# Altium project WashingMachine.PrjPcb
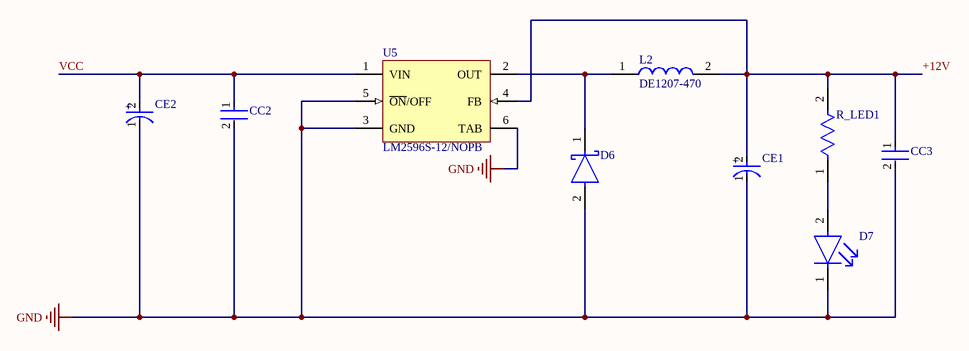
[diagram p0: PowerSupply.SchDoc]
5 sheets, 103 parts. Net scope: global (net labels, ports and power ports of the same name join across sheets).
Board file: PCB1.PcbDoc
Sheets:
  PowerSupply.SchDoc
  HBridge.SchDoc
  Microcontroller.SchDoc
  Relay.SchDoc
  Triac.SchDoc

## Sheet PowerSupply.SchDoc
size A; SheetNumber: 1; SheetTotal: 5

### Parts
CC2  12062C104K4T2A  [FP-1206-L_3_2_0_2-W_1_6_0-IPC_A]  (value not drawn)
CC3  12062C104K4T2A  [FP-1206-L_3_2_0_2-W_1_6_0-IPC_A]  (value not drawn)
CE1  EEV-FK2A221M  [FP-FKK16-MFG]  (value not drawn)
CE2  50THV100M10X10.5  [FP-THV10X10_5-MFG]  (value not drawn)
D6  SS34-E3/57T  [FP-95402-MFG]  (value not drawn)
D7  SML-LX0603SIW-TR  [FP-SML-LX0603SIW-TR-MFG]  (value not drawn)
L2  DE1207-470  [DE1207330]
R_LED1  CRCW0805220RJNEA  [FP-CRCW0805-e3-IPC_A]  (value not drawn)
U5  LM2596S-12/NOPB  [KTT0005B_M]

### Nets
+12V: CC3.1 CE1.2(A) L2.2 R_LED1.2 U5.4(FB)
GND: CC2.2 CC3.2 CE1.1(C) CE2.1(C) D6.2(A) D7.1(C) U5.3(GND) U5.5(~{ON}/OFF) U5.6(TAB)
VCC: CC2.1 CE2.2(A) U5.1(VIN)
NetD6_1: D6.1(C) L2.1 U5.2(OUT)
NetD7_2: D7.2(A) R_LED1.1

### Notes on the sheet
- (in symbol CMP-05427-000076-1) +
- (in symbol CMP-35376-000015-1) +

### Library data of the parts
CC2 CC3 = CMP-04427-012685-1: Automotive Ceramic Capacitor, 1206, 100nF, 10%, X7R, 15%, 200V; Voltage Rating (DC): 200V; Case/Package: 1206; Length: 3.2mm; Max Operating Temperature: 125°C; Termination: SMD/SMT; Width: 1.6mm; Lead Free: Lead Free; Package Quantity: 2000; Min Operating Temperature: -55°C; Capacitance: 100nF; Height: 1.52mm; Depth: 1.6mm; Dielectric: X7R; Case Code (Metric): 3216; Packaging: Tape and Reel; Case Code (Imperial): 1206; Tolerance: 10%
CE1 = CMP-05427-000076-1: CAP ALUM 220UF 20% 100V SMD; Dielectric Material: Aluminium; Ripple Current (AC): 917mA; Life (Hours): 5000Hour; Leakage Current: 3uA; Impedance: 153mR; Height: 16.5mm; Min Operating Temperature: -55°C; Lead Free: Lead Free; Series: FK; Capacitance: 220uF; Construction: Cylindrical; Package Quantity: 1; Height - Seated (Max): 0.65inch; REACH SVHC: No SVHC; Diameter: 18mm; Tolerance: 20%; Voltage Rating (DC): 100V; Mount: Surface Mount; Termination: SMD/SMT; Case/Package: Radial; Voltage Rating: 100V; Ripple Current: 917mA; Packaging: Tape and Reel; Max Operating Temperature: 105°C; Voltage: 100V; RoHS Compliant: Yes; Length: 17mm; Width: 1.2mm; ESR (Equivalent Series Resistance): 153mR; Contact Plating: Tin; Radiation Hardening: No; Number of Pins: 2
CE2 = CMP-35376-000015-1: CAP ALUM 100UF 20% 50V SMD; Ripple Current: 175mA; Ripple Current (AC): 350mA; ESR (Equivalent Series Resistance): 250mR; Life (Hours): 3000Hour; Max Operating Temperature: 125°C; Height: 10.5mm; Package Quantity: 1; Radiation Hardening: No; Diameter: 10mm; Capacitance: 100uF; Case/Package: Radial; RoHS Compliant: Yes; Voltage: 50V; REACH SVHC: No SVHC; Packaging: Cut Tape; Height - Seated (Max): 0.413inch; Voltage Rating: 50V; Min Operating Temperature: -40°C; Mount: Surface Mount; Termination: SMD/SMT; Series: THV; Construction: Cylindrical; Voltage Rating (DC): 50V; Tolerance: 20%
D6 = CMP-02539-000012-1: DIODE SCHOTTKY 40V 3A DO214AB; Manufacturer: Vishay; Max Junction Temp: +150°C; Peak Reverse Current: 0.5mA; Max Surge Forward Current: 100A; Standoff Height: 0mm; ComponentLink2Description: Datasheet; Device Class L3: Schottky Diodes; Height: 2.62mm; Max Repetitive Reverse Voltage: 40V; Lead Free: Yes; Package: 95402; Temperature Range High: +150°C; ComponentLink2URL: http://www.vishay.com/docs/88751/ss32.pdf; Temperature: -55°C to +150°C; Footprint Url: http://www.vishay.com/docs/95402/smc.pdf; Automotive: No; Forward Current: 3A; Category: Diode; Manufacturer Part Number: SS34-E3/57T; RoHS: TRUE; Device Class L2: Diodes; Mouser Description: Schottky Diodes & Rectifiers 3.0 Amp 40 Volt; Octopart: https://octopart.com/ss34-e3%2F57t-vishay-39552907; Temperature Range Low: -55°C; Device Class L1: Discrete Semiconductors; Digikey Description: DIODE SCHOTTKY 40V 3A DO214AB
D7 = CMP-57192-000009-1: LED RED DIFFUSED SMD; Test Current: 20mA; Forward Voltage: 2V; Approvals: UL; Dominant Wavelength: 636nm; Viewing Angle: 140°; Lens Color: White; Luminous Intensity: 60mcd; Power Rating: 50mW; Number of LEDs: 1; Color: Red; Forward Current: 20mA; Moisture Sensitivity Level: 2; Case Code (Imperial): 0603; Lead Free: Lead Free; Lens Transparency: Diffused; Case Code (Metric): 1608; Height: 0.6mm; Max Operating Temperature: 85°C; Width: 0.8mm; Lens Style: Diffused; Illumination Color: Red; Wavelength: 636nm; REACH SVHC: No SVHC; Package Quantity: 1; RoHS Compliant: Yes; Case/Package: 0603; Number of Pins: 2; Packaging: Tape and Reel; Length: 1.6mm; Mount: Surface Mount; Min Operating Temperature: -25°C
L2 = DE1207-330: Inductor; Manufacturer_Name: FERROCORE; Datasheet Link: https://www.tme.eu/Document/d1f8b47d020ebf11f3b92c6891638dfa/de.pdf; Height: 8mm; Manufacturer_Part_Number: DE1207-330
R_LED1 = CMP-2001-03683-2: RES Thick Film, 220Ω, 5%, 0.125W, 200ppm/°C, 0805; Voltage Rating: 150V; Power Rating: 125mW; Resistance: 220R; Case Code (Metric): 2012; Height: 0.45mm; Radiation Hardening: No; Contact Plating: Tin; Voltage Rating (DC): 150V; Packaging: Tape and Reel; Lead Free: Lead Free; Military Standard: Not; Temperature Coefficient: 200ppm/°C; Width: 1.25mm; Case Code (Imperial): 0805; Termination: SMD/SMT; Tolerance: 5%; Depth: 1.25mm; Package Quantity: 5000; Weight: 0.000194oz; Length: 2mm; Min Operating Temperature: -55°C; Composition: Thick Film; Case/Package: 0805; Max Operating Temperature: 155°C
U5 = CMP-0069-00273-3: SIMPLE SWITCHER® Power Converter 150 KHz 3A Step-Down Voltage Regulator, 5-pin TO-263, Pb-Free; Manufacturer: Texas Instruments; PowerWise: N; PackageTopMarking: NSUZXYTTE#*LM2596S*-12 P+; PinCount: 5; ComponentLink1Description: Datasheet URL; PackageDescription: TO-263, Molded, .400 x .390 x .180in, 5 Lead, .067in Pitch, Surface Mount; Code_JEDEC: MO-169-AB; RoHS: Y; PackageReference: KTT0005B; ComponentLink1URL: http://www.ti.com/general/docs/lit/getliterature.tsp?genericPartNumber=LM2596&fileType=pdf; CompType: Switcher

## Sheet HBridge.SchDoc
size A3; SheetNumber: 2; SheetTotal: 5
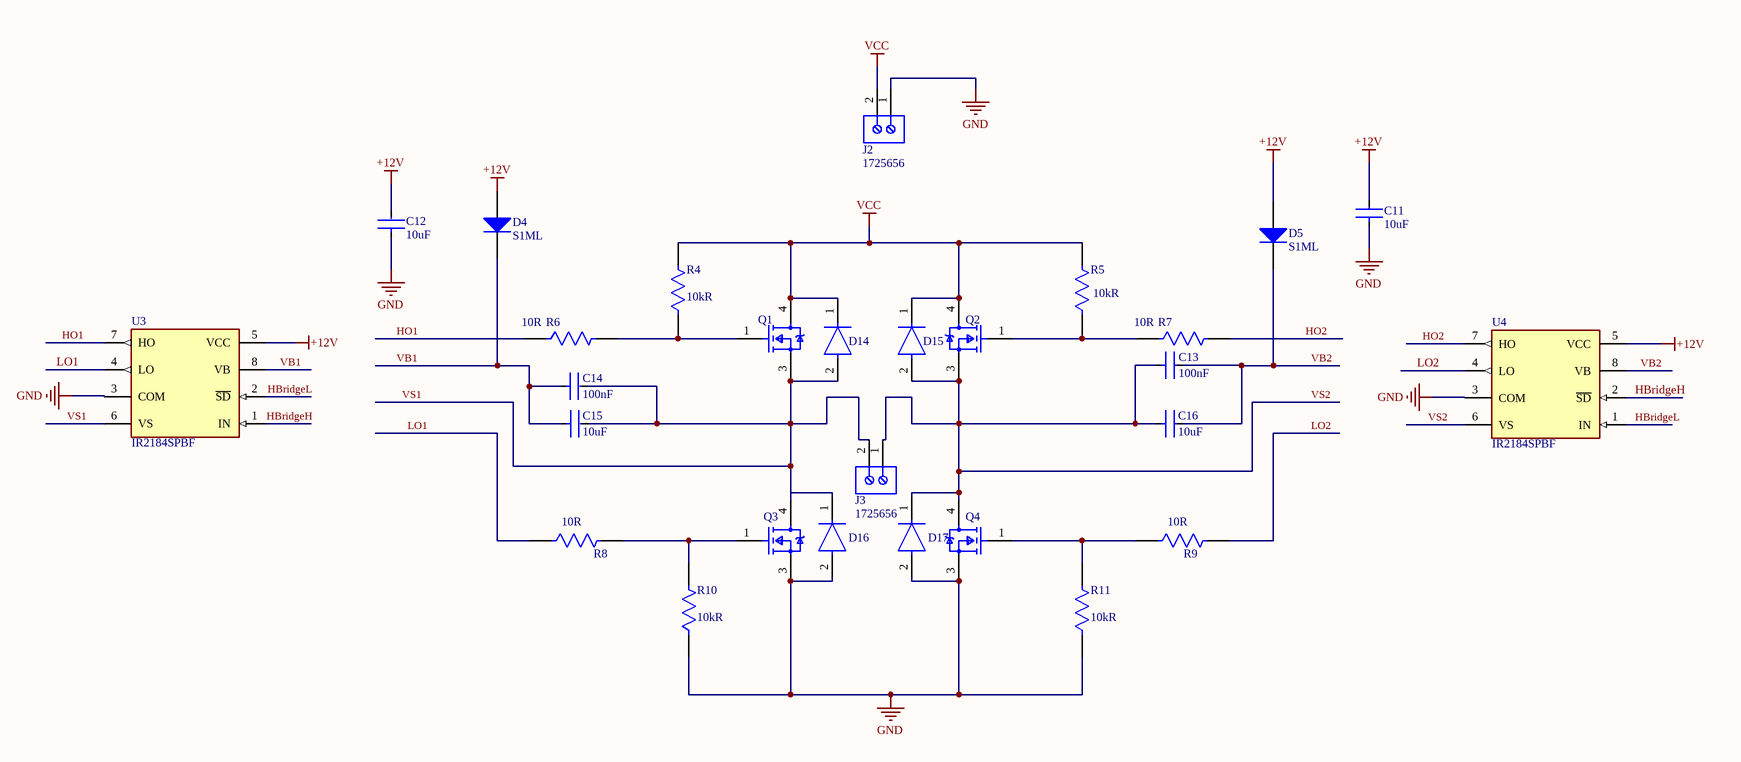
[diagram p1: HBridge.SchDoc]

### Parts
C11  Capacitance: 10uF  [FP-CL21-IPC_B]  (hidden comment: CL21A106KOQNNNE)
C12  Capacitance: 10uF  [FP-CL21-IPC_B]  (hidden comment: CL21A106KOQNNNE)
C13  Capacitance: 100nF  [FP-CL21-IPC_C]  (hidden comment: CL21B104KBCNNNC)
C14  Capacitance: 100nF  [FP-CL21-IPC_C]  (hidden comment: CL21B104KBCNNNC)
C15  Capacitance: 10uF  [FP-CL21-IPC_B]  (hidden comment: CL21A106KOQNNNE)
C16  Capacitance: 10uF  [FP-CL21-IPC_B]  (hidden comment: CL21A106KOQNNNE)
D4  S1ML  [TWS-S1ML_V]
D5  S1ML  [TWS-S1ML_V]
D14  1N4148WQ-7-F  [FP-SOD123-MFG]  (value not drawn)
D15  1N4148WQ-7-F  [FP-SOD123-MFG]  (value not drawn)
D16  1N4148WQ-7-F  [FP-SOD123-MFG]  (value not drawn)
D17  1N4148WQ-7-F  [FP-SOD123-MFG]  (value not drawn)
J2  1725656  [PHOE-1725656-2]
J3  1725656  [PHOE-1725656-2]
Q1  IRLZ44NSTRLPBF  [FP-PG-TO263-3-MFG]  (value not drawn)
Q2  IRLZ44NSTRLPBF  [FP-PG-TO263-3-MFG]  (value not drawn)
Q3  IRLZ44NSTRLPBF  [FP-PG-TO263-3-MFG]  (value not drawn)
Q4  IRLZ44NSTRLPBF  [FP-PG-TO263-3-MFG]  (value not drawn)
R4  Resistance: 10kR  [FP-MCA1206-IPC_B]  (hidden comment: MCA1206MD1002DP500)
R5  Resistance: 10kR  [FP-MCA1206-IPC_B]  (hidden comment: MCA1206MD1002DP500)
R6  Resistance: 10R  [FP-RMCF0805-IPC_B]  (hidden comment: RMCF0805FG10R0)
R7  Resistance: 10R  [FP-RMCF0805-IPC_B]  (hidden comment: RMCF0805FG10R0)
R8  Resistance: 10R  [FP-RMCF0805-IPC_B]  (hidden comment: RMCF0805FG10R0)
R9  Resistance: 10R  [FP-RMCF0805-IPC_B]  (hidden comment: RMCF0805FG10R0)
R10  Resistance: 10kR  [FP-MCA1206-IPC_B]  (hidden comment: MCA1206MD1002DP500)
R11  Resistance: 10kR  [FP-MCA1206-IPC_B]  (hidden comment: MCA1206MD1002DP500)
U3  IR2184SPBF  [FP-PG-DSO-8-MFG]
U4  IR2184SPBF  [FP-PG-DSO-8-MFG]

### Nets
+12V: C11.2 C12.2 D4.1(A) D5.1(A) U3.5(VCC) U4.5(VCC)
GND: C11.1 C12.1 D16.2(A) D17.2(A) J2.1 Q3.3(S) Q4.3(S) R10.1 R11.1 U3.3(COM) U4.3(COM)
VCC: D14.1(C) D15.1(C) J2.2 Q1.4(D) Q2.4(D) R4.2 R5.2
HBridgeH: U3.1(IN) U4.2(~{SD})
HBridgeL: U3.2(~{SD}) U4.1(IN)
HO1: R6.1 U3.7(HO)
HO2: R7.2 U4.7(HO)
LO1: R8.1 U3.4(LO)
LO2: R9.2 U4.4(LO)
VB1: C14.1 C15.1 D4.2(K) U3.8(VB)
VB2: C13.2 C16.2 D5.2(K) U4.8(VB)
VS1: C14.2 C15.2 D14.2(A) D16.1(C) J3.2 Q1.3(S) Q3.4(D) U3.6(VS)
VS2: C13.1 C16.1 D15.2(A) D17.1(C) J3.1 Q2.3(S) Q4.4(D) U4.6(VS)
NetQ1_1: Q1.1(G) R4.1 R6.2
NetQ2_1: Q2.1(G) R5.1 R7.1
NetQ3_1: Q3.1(G) R8.2 R10.2
NetQ4_1: Q4.1(G) R9.1 R11.2

### Library data of the parts
C11 C12 C15 C16 = CMP-2000-06102-2: CL21 Series 0805 10uF 16V ±10% Tolerance X5R Multilayer Ceramic Chip Capacitor; Dielectric: X7R; Length: 2mm; Depth: 1.25mm; Voltage: 16V; Width: 0.049inch; Lead Free: Lead Free; Max Operating Temperature: 85°C; Mount: Surface Mount; Voltage Rating: 16V; Height: 1.25mm; Radiation Hardening: No; Packaging: Tape and Reel; Voltage Rating (DC): 16V; Thickness: 0.055inch; Case/Package: 0805; Case Code (Imperial): 0805; Min Operating Temperature: -55°C; Case Code (Metric): 2012; Package Quantity: 1; Tolerance: 10%
C13 C14 = CMP-2000-05017-2: CL21 Series 0805 100nF 50V ±10% Tolerance X7R Multilayer Ceramic Chip Capacitor; Depth: 1.25mm; Height: 0.85mm; Width: 0.049inch; Tolerance: 10%; Case Code (Metric): 2012; Case Code (Imperial): 0805; Material: Ceramic; Thickness: 0.037inch; Min Operating Temperature: -55°C; Contact Plating: Tin; Length: 2mm; Mount: Surface Mount; Voltage Rating (DC): 50V; Lead Free: Lead Free; Dielectric: X7R; Radiation Hardening: No; Voltage Rating: 50V; Case/Package: 0805; Packaging: Tape and Reel; Max Operating Temperature: 125°C; Voltage: 50V
D4 D5 = CMP-2000-07014-1: Rectifier, 1 A, 1.1 V, -55 to 175 degC, 2-Pin SMD, RoHS, Tape and Reel; Manufacturer: Taiwan Semiconductor; Forward Current If(AV): 1A; Forward Voltage VF Max: 1.1V; Diode Configuration: Single; Reverse Recovery Time trr Max: 1.8µs; Forward Surge Current Ifsm Max: 30A; SVHC: NoSVHC(15-Jun-2015); Repetitive Reverse Voltage Vrrm Max: 1kV; No. of Pins: 2Pin; Mounting Technology: SurfaceMount; Package Reference: S1ML; Datasheet URL: http://www.taiwansemi.com/products/datasheet/S1AL%20SERIES_O15.pdf; Manufacturer URL: http://www.taiwansemi.com/; Package Description: 2-Pin Surface Mount Device, Body 2.8 x 1.8 mm; Product Range: -; Diode Case Style: SMD; Datasheet Version: Rev. O15, 05/2015; Packaging: CutTape; Operating Temperature Max: 150°C
D14-D17 = CMP-12791-000025-1: DIODE GEN PURP 100V 300MA SOD123; Manufacturer: Diodes Inc.; Value: 2pF; Standoff Height: 0mm; Automotive Grade: Grade 0; Max Junction Temp: +150°C; Max Surge Forward Current: 1A; Peak Reverse Current: 1uA; Forward Current: 300mA; Temperature: -65°C to +150°C; Device Class L3: Rectifier Diodes; Manufacturer Part Number: 1N4148WQ-7-F; Temperature Range Low: -65°C; Device Class L1: Discrete Semiconductors; Reverse Voltage: 100V; Automotive: Yes; Temperature Range High: +150°C; Octopart: https://octopart.com/1n4148wq-7-f-diodes+inc.-34965875; ComponentLink2URL: https://www.diodes.com/assets/Datasheets/ds30086.pdf; Max Repetitive Reverse Voltage: 100V; Mouser Description: Diode Switching 100V 0.15A Automotive 2-Pin SOD-123 T/R; Ipc Land Pattern Name: SOD365155X123-2; RoHS: TRUE; Height: 1.45mm; ComponentLink2Description: Datasheet; Category: Diode; Footprint Url: https://www.diodes.com/assets/Package-Files/SOD123.pdf; Package: SOD123; Device Class L2: Diodes; Lead Free: Yes; Capacitance: 2pF; Digikey Description: DIODE GEN PURP 100V 300MA SOD123
J2 J3 = CMP-2000-05299-1: Male Header, Pitch 2.54 mm, 1 x 2 Position, Height 9 mm, Tail Length 3.5 mm; Manufacturer: Phoenix Contact; Number of contacts: 2; Content: 250pc(s); Pitch: 2.54mm; Industrial packaging: Yes; Colour: Green; Manufacturer part No.: 1725656; Type: MPT0,5/2-2,54; Datasheet URL: http://datasheet.octopart.com/1725656-Phoenix-Contact-datasheet-5302866.pdf; Manufacturer URL: http://www.phoenixcontact.com/; Datasheet Version: Apr-08
Q1-Q4 = CMP-32901-000495-1: MOSFET N-CH 55V 47A D2PAK; Rds On Max: 22mR; Input Capacitance: 1.7nF; Turn-On Delay Time: 11ns; Turn-Off Delay Time: 26ns; Power Dissipation: 110W; Element Configuration: Single; Gate to Source Voltage (Vgs): 16V; Drain to Source Resistance: 35mR; Threshold Voltage: 2V; Max Power Dissipation: 3.8W; Lead Free: Contains Lead; Max Dual Supply Voltage: 55V; Width: 0.38inch; Mount: Surface Mount; Continuous Drain Current (ID): 47A; Min Operating Temperature: -55°C; Number of Pins: 3; REACH SVHC: No SVHC; Height: 0.19inch; Length: 0.42inch; Case/Package: D2PAK; Drain to Source Breakdown Voltage: 55V; Packaging: Tape and Reel; Drain to Source Voltage (Vdss): 55V; Halogen Free: Halogen Free; RoHS Compliant: Yes; Max Operating Temperature: 175°C
R4 R5 R10 R11 = CMP-02407-011266-1: Res MC AT Professional Thin Film 1206 10kΩ 0.5% 0.4W ±25ppm/°C Molded Paper T/R; Voltage Rating: 200V; Max Power Dissipation: 400mW; Weight: 0.000325oz; Height: 0.55mm; Case Code (Imperial): 1206; Packaging: Tape and Reel; Series: MCA AT - Professional; Width: 1.6mm; Resistor Type: Thin Film; Tolerance: 0.5%; Max Operating Temperature: 175°C; Termination: SMD/SMT; Min Operating Temperature: -55°C; Temperature Coefficient: 25ppm/°C; Number of Terminations: 2; Length: 3.2mm; RoHS Compliant: Yes; Case Code (Metric): 3216; Case/Package: 1206; Features: Automotive AEC-Q200; Power Rating: 400mW
R6-R9 = CMP-26527-004108-1: 10Ω ±1% 0.125W 0805 Thick Film Chip Resistor AEC-Q200 compliant; Max Power Dissipation: 125mW; Temperature Coefficient: 100ppm/°C; Series: RMCF; Resistor Type: Thick Film; Width: 0.049inch; Contact Plating: Tin; Number of Terminations: 2; Radiation Hardening: No; Max Operating Temperature: 155°C; Length: 0.079inch; RoHS Compliant: Yes; Mount: Surface Mount; Tolerance: 1%; Case/Package: 0805; Packaging: Tape and Reel; Min Operating Temperature: -55°C; Height: 0.026inch; Features: Automotive AEC-Q200
U3 U4 = CMP-32851-000025-1: IC GATE DRVR HALF-BRIDGE 8SOIC; Manufacturer: Infineon; Min Supply Voltage: 10V; Number Of Outputs: 1; Turn On Delay Time: 680ns; Max Supply Voltage: 20V; Number Of Drivers: 2; Max Junction Temp: +150°C; Nominal Supply Current: 60-1000uA; Turn Off Delay Time: 270ns; Standoff Height: 0.1mm; Max Power Dissipation: 0.625W; Rise Time: 40ns; Fall Time: 20ns; Temperature: to +150°C; Height: 1.75mm; Ambient Temperature Range High: +125°C; Manufacturer Part Number: IR2184SPBF; ComponentLink2URL: https://www.infineon.com/dgdl/ir2184.pdf?fileId=5546d462533600a4015355c955e616d4; ComponentLink2Description: Datasheet; RoHS: TRUE; Octopart: https://octopart.com/ir2184spbf-infineon-65872954; Ipc Land Pattern Name: SOIC127P600X155-8; Package: PG-DSO-8; Footprint Url: https://www.infineon.com/dgdl/Infineon-po-8leadsoic-P-v01_00-EN.pdf?fileId=5546d462580663ef0158068b4ad80177; Category: IC; Digikey Description: IC GATE DRVR HALF-BRIDGE 8SOIC; Automotive: No; Device Class L3: Gate Drivers; Device Class L2: Power Management ICs; Temperature Range High: +150°C; Lead Free: Yes; Ambient Temperature Range Low: -40°C; Device Class L1: Integrated Circuits (ICs)

## Sheet Microcontroller.SchDoc
size A1; SheetNumber: 3; SheetTotal: 5
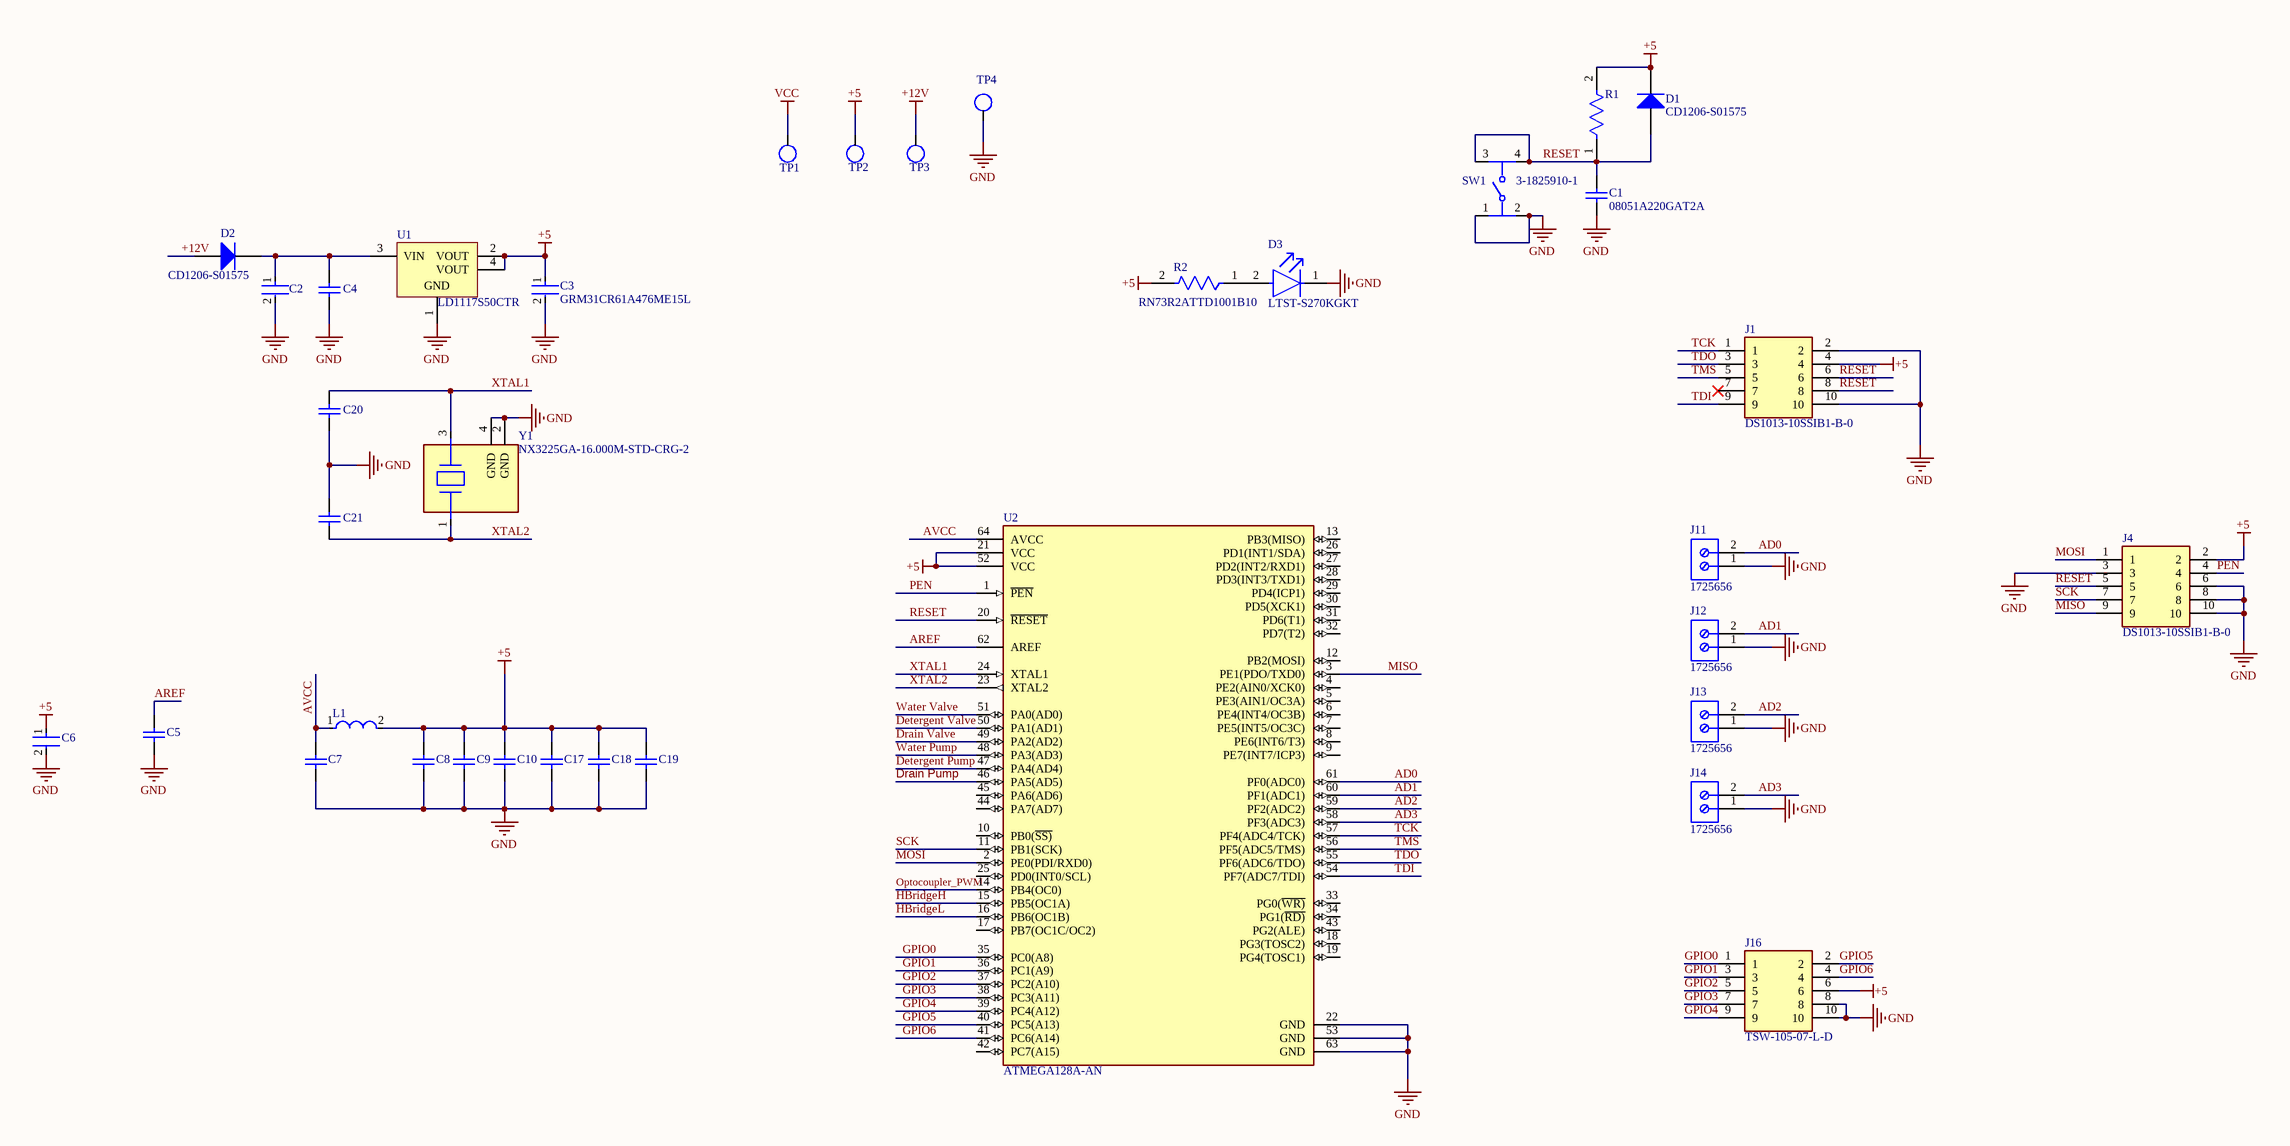
[diagram p2: Microcontroller.SchDoc]

### Parts
C1  08051A220GAT2A  [CAPC2013X94X50ML20T25]
C2  GRM31CR61A476ME15L  [FP-GRM31C-0_2-e0_3_0_8-IPC_B]  (value not drawn)
C3  GRM31CR61A476ME15L  [FP-GRM31C-0_2-e0_3_0_8-IPC_B]
C4  VJ0805Y104KFAAT  [CAPC2013X145X48NL20T23]  (value not drawn)
C5  CAP 100nF 100V 1206(3216)  [CAPC1206(3216)170_M]  (value not drawn)
C6  C1206C107M9PACTU  [FP-C1206C-EH-MFG]  (value not drawn)
C7  CAP 100nF 100V 1206(3216)  [CAPC1206(3216)170_M]  (value not drawn)
C8  CAP 100nF 100V 1206(3216)  [CAPC1206(3216)170_M]  (value not drawn)
C9  CAP 100nF 100V 1206(3216)  [CAPC1206(3216)170_M]  (value not drawn)
C10  CAP 100nF 100V 1206(3216)  [CAPC1206(3216)170_M]  (value not drawn)
C17  CAP 100nF 100V 1206(3216)  [CAPC1206(3216)170_M]  (value not drawn)
C18  CAP 100nF 100V 1206(3216)  [CAPC1206(3216)170_M]  (value not drawn)
C19  CAP 100nF 100V 1206(3216)  [CAPC1206(3216)170_M]  (value not drawn)
C20  VJ0805Y104KFAAT  [CAPC2013X145X48NL20T23]  (value not drawn)
C21  VJ0805Y104KFAAT  [CAPC2013X145X48NL20T23]  (value not drawn)
D1  CD1206-S01575  [BOUR-CD1206-S01575-2_L]
D2  CD1206-S01575  [BOUR-CD1206-S01575-2_L]
D3  LTST-S270KGKT  [FP-LTST-S270KGKT-MFG]
J1  DS1013-10SSIB1-B-0  [DS101310SSIB1B0]
J4  DS1013-10SSIB1-B-0  [DS101310SSIB1B0]
J11  1725656  [PHOE-1725656-2]
J12  1725656  [PHOE-1725656-2]
J13  1725656  [PHOE-1725656-2]
J14  1725656  [PHOE-1725656-2]
J16  TSW-105-07-L-D  [TSW-105-XX-YY-D]
L1  MLZ2012N100LTD25  [FP-MLZ2012-1_25-MFG]  (value not drawn)
R1  RN73C2A10KLTDF  [FP-RN732A-MFG]  (value not drawn)
R2  RN73R2ATTD1001B10  [FP-RN73R2A-IPC_A]
SW1  3-1825910-1  [FP-3-1825910-1-MFG]
TP1  testpoint  [testpoint]  (value not drawn)  (no BOM)
TP2  testpoint  [testpoint]  (value not drawn)  (no BOM)
TP3  testpoint  [testpoint]  (value not drawn)  (no BOM)
TP4  testpoint  [testpoint]  (value not drawn)  (no BOM)
U1  LD1117S50CTR  [SOT-223_N]
U2  ATMEGA128A-AN  [FP-64A-MFG]
Y1  NX3225GA-16.000M-STD-CRG-2  [FP-NX3225GA-MFG]

### Nets
+5: C3.1 C6.1 C8.2 C9.2 C10.2 C17.2 C18.2 C19.2 D1.2(K) J1.4 J4.2 J16.6 L1.2 R1.2 R2.2 TP2.1 U1.2(VOUT) U1.4(VOUT) U2.21(VCC) U2.52(VCC)
+12V: D2.1(A) TP3.1
GND: C1.1 C2.2 C3.2 C4.1 C5.1 C6.2 C7.1 C8.1 C9.1 C10.1 C17.1 C18.1 C19.1 C20.1 C21.2 D3.1(C) J1.2 J1.10 J4.3 J4.6 J4.8 J4.10 J11.1 J12.1 J13.1 J14.1 J16.8 J16.10 SW1.1 SW1.2 TP4.1 U1.1(GND) U2.22(GND) U2.53(GND) U2.63(GND) Y1.2(GND) Y1.4(GND)
VCC: TP1.1
AD0: J11.2 U2.61(PF0(ADC0))
AD1: J12.2 U2.60(PF1(ADC1))
AD2: J13.2 U2.59(PF2(ADC2))
AD3: J14.2 U2.58(PF3(ADC3))
AREF: C5.2 U2.62(AREF)
AVCC: C7.2 L1.1 U2.64(AVCC)
Detergent Pump: U2.47(PA4(AD4))
Detergent Valve: U2.50(PA1(AD1))
Drain Pump: U2.46(PA5(AD5))
Drain Valve: U2.49(PA2(AD2))
GPIO0: J16.1 U2.35(PC0(A8))
GPIO1: J16.3 U2.36(PC1(A9))
GPIO2: J16.5 U2.37(PC2(A10))
GPIO3: J16.7 U2.38(PC3(A11))
GPIO4: J16.9 U2.39(PC4(A12))
GPIO5: J16.2 U2.40(PC5(A13))
GPIO6: J16.4 U2.41(PC6(A14))
HBridgeH: U2.15(PB5(OC1A))
HBridgeL: U2.16(PB6(OC1B))
MISO: J4.9 U2.3(PE1(PDO/TXD0))
MOSI: J4.1 U2.2(PE0(PDI/RXD0))
Optocoupler_PWM: U2.14(PB4(OC0))
PEN: J4.4 U2.1(~{PEN})
RESET: C1.2 D1.1(A) J1.6 J1.8 J4.5 R1.1 SW1.3 SW1.4 U2.20(~{RESET})
SCK: J4.7 U2.11(PB1(SCK))
TCK: J1.1 U2.57(PF4(ADC4/TCK))
TDI: J1.9 U2.54(PF7(ADC7/TDI))
TDO: J1.3 U2.55(PF6(ADC6/TDO))
TMS: J1.5 U2.56(PF5(ADC5/TMS))
Water Pump: U2.48(PA3(AD3))
Water Valve: U2.51(PA0(AD0))
XTAL1: C20.2 U2.24(XTAL1) Y1.3
XTAL2: C21.1 U2.23(XTAL2) Y1.1
NetC2_1: C2.1 C4.2 D2.2(K) U1.3(VIN)
NetD3_2: D3.2(A) R2.1

Not connected (* = marked no-connect by the designer): J1 7*; U2 4(PE2(AIN0/XCK0)) 5(PE3(AIN1/OC3A)) 6(PE4(INT4/OC3B)) 7(PE5(INT5/OC3C)) 8(PE6(INT6/T3)) 9(PE7(INT7/ICP3)) 10(PB0(~{SS)}) 12(PB2(MOSI)) 13(PB3(MISO)) 17(PB7(OC1C/OC2)) 18(PG3(TOSC2)) 19(PG4(TOSC1)) 25(PD0(INT0/SCL)) 26(PD1(INT1/SDA)) 27(PD2(INT2/RXD1)) 28(PD3(INT3/TXD1)) 29(PD4(ICP1)) 30(PD5(XCK1)) 31(PD6(T1)) 32(PD7(T2)) 33(PG0(~{WR)}) 34(PG1(~{RD)}) 42(PC7(A15)) 43(PG2(ALE)) 44(PA7(AD7)) 45(PA6(AD6))

### Library data of the parts
C1 = CMP-1036-01254-2: Manufacturer: AVX Interconnect / Elco; Part Number: 08051A220GAT2A
C2 C3 = CMP-2000-05255-3: Chip Multilayer Ceramic Capacitors for General Purpose, 1206, 47uF, X5R, 15%, 20%, 10V; Case/Package: 1206; Radiation Hardening: No; Case Code (Metric): 3216; Max Operating Temperature: 85°C; Capacitance: 47uF; Tolerance: 20%; REACH SVHC: No SVHC; Depth: 1.6mm; Case Code (Imperial): 1206; Termination: SMD/SMT; Voltage Rating (DC): 10V; Package Quantity: 2000; Voltage Rating: 10V; Width: 1.6mm; Lead Free: Lead Free; Voltage: 10V; Packaging: Tape and Reel; Length: 3.2mm; Height: 1.6mm; Number of Pins: 2; Thickness: 0.071inch; Min Operating Temperature: -55°C; Dielectric: X5R; Mount: Surface Mount
C4 C20 C21 = CMP-2007-01868-1: Manufacturer: Vitramon; Part Number: VJ0805Y104KFAAT
C5 C7-C10 C17-C19 = CMP-1037-04207-2: CAP 100nF 100V ±5% 1206 (3216 Metric) Thickness 1.7mm SMD; Case-Metric: 3216; Case-EIA: 1206; Tolerance: Â±5%; Rated Voltage: 100 V; Technology: SMT; Value: 100nF; Max Thickness: 1.7 mm
C6 = CMP-1037-05005-3: CAP CER 100UF 6.3V X5R 1206; Dielectric Material: Ceramic; Tolerance: 2%; Dissipation Factor: 5%; Min Operating Temperature: -55°C; Case Code (Imperial): 1206; Case Code (Metric): 3216; Depth: 1.6mm; Dielectric: X5R; Max Operating Temperature: 85°C; Packaging: Tape and Reel; Construction: Flat; Series: C; Case/Package: 1206; Radiation Hardening: No; Voltage Rating (DC): 6.3V; Termination: SMD/SMT; Voltage Rating: 6.3V; Capacitance: 100uF; Number of Pins: 2; RoHS Compliant: Yes; Height: 1.6mm; Lead Free: Lead Free; Voltage: 6.3V; REACH SVHC: No SVHC; Length: 3.2mm; Mount: Surface Mount; Package Quantity: 1; Thickness: 0.071inch; Width: 0.063inch
D1 D2 = CMP-0583-00001-2: 75 V Small Signal Switching Diode, 150 mA, 2.5 uA, 1026 Molded Package, RoHS, Tape and Reel; Manufacturer: Bourns; Reverse Voltage: 75 V; Average Forward Current: 150 mA; Reverse Current (Max.): 2.5 uA; Capacitance Between Terminals (Max.): 3 pF; Reverse Recovery Time (Max.): 4 nS; Forward Voltage (Max.): 1.00 V; Packing: Tape and Reel; Mounting Technology: Surface Mount; DatasheetVersion: Rev. 06/11; ComponentLink2URL: http://www.bourns.com/data/global/pdfs/CD1206_S01575.pdf; PackageReference: CD1206-S01575-2; RoHS: TRUE; ComponentLink1URL: http://www.bourns.com/; ComponentLink1Description: Manufacturer URL; ComponentLink3Description: Package Specification; ComponentLink3URL: http://www.bourns.com/data/global/pdfs/CD1206_S01575.pdf; ComponentLink2Description: Datasheet; PackageDescription: 2-Pin SMD, Body 3.2 x 1.5 mm; PartNumber: CD1206-S01575
D3 = CMP-2000-06629-2: LED GREEN CLEAR CHIP SMD R/A; Luminous Intensity: 71mcd; Test Current: 20mA; Dominant Wavelength: 571nm; Lens Style: Diffused; Forward Voltage: 2V; Reverse Voltage: 5V; Wavelength: 574nm; Power Rating: 75mW; Viewing Angle: 130°; Number of Elements: 1; Forward Current: 30mA; Lens Color: Colorless; Package Quantity: 1; Lead Free: Lead Free; Case Code (Imperial): 0603; Lens Transparency: Clear; Width: 1.15mm; Case Code (Metric): 1608; Packaging: Tape and Reel; Depth: 0.6mm; Radiation Hardening: No; Color: Green; Max Operating Temperature: 85°C; Case/Package: 0603; Min Operating Temperature: -55°C; Number of LEDs: 1; Power Dissipation: 75mW; Illumination Color: Green; Number of Pins: 2; Height: 0.6mm; Mount: Surface Mount; Length: 1.6mm
J1 J4 = DS1013-10SSIB1-B-0: Connector; Manufacturer_Name: Connfly; Datasheet Link: https://www.tme.eu/Document/c6e6da985bd9c519d97c4924b5c8a047/DS1013.pdf; Height: 9.48mm; Manufacturer_Part_Number: DS1013-10SSIB1-B-0
J11-J14 = CMP-2000-05299-1: as J2 on sheet HBridge; Colour: Green; Manufacturer part No.: 1725656; Type: MPT0,5/2-2,54; Datasheet URL: http://datasheet.octopart.com/1725656-Phoenix-Contact-datasheet-5302866.pdf; Manufacturer URL: http://www.phoenixcontact.com/; Datasheet Version: Apr-08
J16 = TSW-105-07-L-D: Connector; Manufacturer_Name: SAMTEC; Datasheet Link: http://suddendocs.samtec.com/prints/tsw-xxx-xx-xxx-x-xx-xxx-mkt.pdf; Manufacturer_Part_Number: TSW-105-07-L-D; Mouser Part Number: 200-TSW10507LD; Mouser Price/Stock: https://www.mouser.co.uk/ProductDetail/Samtec/TSW-105-07-L-D?qs=iT52DjcXudvrrMSG1pzmcQ%3D%3D; Arrow Part Number: TSW-105-07-L-D; Arrow Price/Stock: https://www.arrow.com/en/products/tsw-105-07-l-d/samtec?region=europe
L1 = CMP-08253-000042-1: Shielded Multilayer Inductor 10uH ±20% 500mA 390mΩ AEC-Q200 SMD 0805; Test Frequency: 2MHz; Saturation Current: 110mA; DC Resistance (DCR): 390mR; Core Material: Ferrite; Resistance: 0.39R; Width: 0.049inch; RoHS Compliant: Yes; Current Rating: 500mA; Weight: 0.000194oz; Inductance: 10uH; Packaging: Tape and Reel; Height: 1.25mm; Mount: Surface Mount; Max DC Current: 500mA; Lead Free: Lead Free; Case Code (Metric): 2012; Length: 0.079inch; Case Code (Imperial): 0805; Min Operating Temperature: -55°C; Package Quantity: 2000; Termination: SMD/SMT; Case/Package: 0805; Shielding: Shielded; Ratings: AEC-Q200; Max Operating Temperature: 125°C; Height - Seated (Max): 0.057inch; Tolerance: 20%
R1 = CMP-03211-000999-1: SMD Chip Resistor, Thin Film, 10.LKΩ, 100 V, 0805 [2012 Metric], 100 mW, 0.1%, RN73 Series; Manufacturer: TE Connectivity; Power Rating: 0.1W; Temperature Coefficient: 10ppm/°C; Tolerance: 42; Voltage Rating: 100V; Composition: Thin Film; Resistance: 10.LKΩ; Temperature Range Low: -55°C; Category: Res; Device Class L1: Passive Components; ComponentLink2Description: Datasheet; Lead Free: Yes; Temperature Range High: 155°C; packaging: 1000 Reel; Series: RN73; ComponentLink2URL: https://www.te.com/commerce/DocumentDelivery/DDEController?Action=showdoc&DocId=Data+Sheet%7F1773270%7FP%7Fpdf%7FEnglish%7FENG_DS_1773270_P.pdf%7F1676162-2; Package: RN732A; Device Class L2: Resistors; Automotive: No; Octopart: https://octopart.com/rn73c2a10kltdf-te+connectivity-22738657; RoHS: TRUE; Temperature: -55°C to 155°C; octopart_url: https://octopart.com/rn73c2a10kltdf-te+connectivity-22738657; Value: 10.LKΩ; Device Class L3: Chip SMD Resistors; Height: 0.65mm; Manufacturer Part Number: RN73C2A10KLTDF; Ipc Land Pattern Name: RESC200125X55
R2 = CMP-04015-026717-1: 1kΩ ±0.1% 0.125W, 1/8W Chip Resistor 0805 (2012 Metric) Moisture Resistant Thin Film
SW1 = CMP-03407-000001-1: SWITCH TACTILE SPST-NO 0.05A 24V; Manufacturer: TE Connectivity; Operating Force: 160gf; Contact Current Rating: 50mA; Contact Resistance: 100mΩ; Electromechanical Life: 100000Cycles; Device Class L1: Electromechanical; ComponentLink2URL: https://www.te.com/commerce/DocumentDelivery/DDEController?Action=srchrtrv&DocNm=1825910&DocType=Customer+Drawing&DocLang=English; Category: Switch; Device Class L2: Switches; Temperature: -35°C to +85°C; RoHS: TRUE; Mount: Through Hole; Manufacturer Part Number: 3-1825910-1; Automotive: No; Lead Free: Yes; Device Class L3: Tactile Switches; ComponentLink2Description: Datasheet; Temperature Range High: +85°C; Height: 17.3mm; Package: 0; Temperature Range Low: -35°C; Throw Configuration: SPST-NO; Digikey Description: SWITCH TACTILE SPST-NO 0.05A 24V; Octopart: https://octopart.com/3-1825910-1-te+connectivity-46506874
U1 = CMP-0244-00311-1: Fixed Low Drop Positive Voltage Regulator, 5V, 4-Pin SOT-223, Tape and Reel; PackageReference: SOT-223; PackageVersion: 2010; ComponentLink2URL: http://www.st.com/internet/com/TECHNICAL_RESOURCES/TECHNICAL_LITERATURE/DATASHEET/CD00000544.pdf; ComponentLink1URL: http://www.st.com; ComponentLink2Description: Datasheet; DatasheetVersion: 1/11/2011; ComponentLink1Description: Manufacturer URL; PackageDescription: 4-Pin SOT-223 Package, 6.5 x 3.5 mm Body, 2.3 mm Pitch, 7 mm Lead Span
U2 = CMP-00252-77759823-2: ATMEGA128A-AN 64KB 2.7V~5.5V AVR 16MHz FLASH 53 LQFP-64(14x14) Microcontroller Units (MCUs/MPUs/SOCs) ROHS; Manufacturer Package Identifier: 64A; Number of I2C Channels: 1; Min Supply Voltage: 2.7V; Oscillator Type: Internal; Memory Size: 128kB; Number of Timers/Counters: 4; Number of ADC Channels: 6; Max Supply Voltage: 5.5V; Data Bus Width: 8b; RAM Size: 4kB; Number of I/Os: 53; Interface: I2C, SPI, UART, USART; Peripherals: Brown-out Detect/Reset, POR, PWM, WDT; Memory Type: FLASH; RoHS: Compliant; Number of Pins: 64; Case/Package: TQFP; Mount: Surface Mount; Schedule B: 8542310000, 8542310000; Number of SPI Channels: 1; Height: 1.2mm; Number of A/D Converters: 1; Min Operating Temperature: -40°C; Core Architecture: AVR; Max Operating Temperature: 85°C; Lead Free: Lead Free; Number of PWM Channels: 6; Lifecycle Status: Production; Frequency: 16MHz; NexarPartId: 77759823
Y1 = CMP-200220-000007-1: CRYSTAL 16.0000MHZ 8PF SMD; Frequency Stability: 30ppm; Frequency Tolerance: 20ppm; Frequency: 16MHz; ESR (Equivalent Series Resistance): 80R; Min Operating Temperature: -40°C; Mount: Surface Mount; Width: 0.098inch; Case/Package: SMD/SMT; Max Operating Temperature: 85°C; Number of Pins: 4; Length: 0.126inch; Load Capacitance: 8pF; Packaging: Tape and Reel; Package Quantity: 3000; Height: 0.035inch

## Sheet Relay.SchDoc
size A1; SheetNumber: 4; SheetTotal: 5
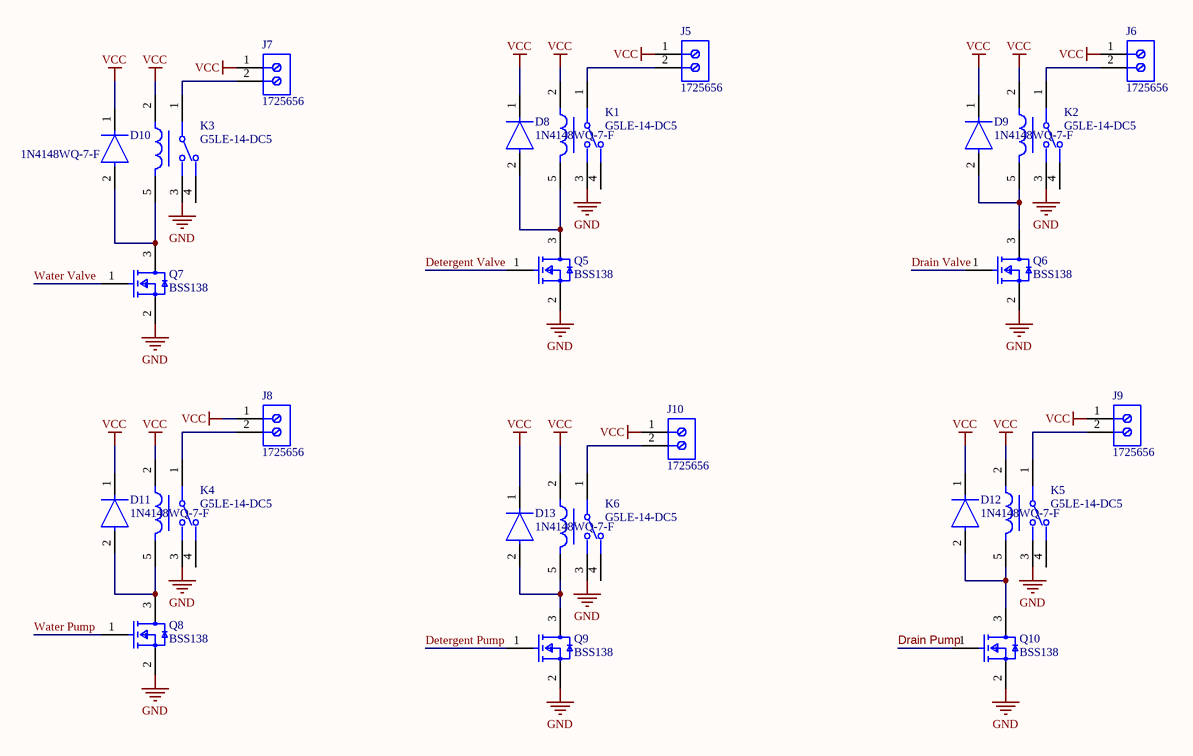
[diagram p3: Relay.SchDoc]

### Parts
D8  1N4148WQ-7-F  [FP-SOD123-MFG]
D9  1N4148WQ-7-F  [FP-SOD123-MFG]
D10  1N4148WQ-7-F  [FP-SOD123-MFG]
D11  1N4148WQ-7-F  [FP-SOD123-MFG]
D12  1N4148WQ-7-F  [FP-SOD123-MFG]
D13  1N4148WQ-7-F  [FP-SOD123-MFG]
J5  1725656  [PHOE-1725656-2]
J6  1725656  [PHOE-1725656-2]
J7  1725656  [PHOE-1725656-2]
J8  1725656  [PHOE-1725656-2]
J9  1725656  [PHOE-1725656-2]
J10  1725656  [PHOE-1725656-2]
K1  G5LE-14-DC5  [FP-G5LE-14-DC5-MFG]
K2  G5LE-14-DC5  [FP-G5LE-14-DC5-MFG]
K3  G5LE-14-DC5  [FP-G5LE-14-DC5-MFG]
K4  G5LE-14-DC5  [FP-G5LE-14-DC5-MFG]
K5  G5LE-14-DC5  [FP-G5LE-14-DC5-MFG]
K6  G5LE-14-DC5  [FP-G5LE-14-DC5-MFG]
Q5  BSS138  [FP-318-08-IPC_A]
Q6  BSS138  [FP-318-08-IPC_A]
Q7  BSS138  [FP-318-08-IPC_A]
Q8  BSS138  [FP-318-08-IPC_A]
Q9  BSS138  [FP-318-08-IPC_A]
Q10  BSS138  [FP-318-08-IPC_A]

### Nets
GND: K1.3 K2.3 K3.3 K4.3 K5.3 K6.3 Q5.2(S) Q6.2(S) Q7.2(S) Q8.2(S) Q9.2(S) Q10.2(S)
VCC: D8.1(C) D9.1(C) D10.1(C) D11.1(C) D12.1(C) D13.1(C) J5.1 J6.1 J7.1 J8.1 J9.1 J10.1 K1.2 K2.2 K3.2 K4.2 K5.2 K6.2
Detergent Pump: Q9.1(G)
Detergent Valve: Q5.1(G)
Drain Pump: Q10.1(G)
Drain Valve: Q6.1(G)
Water Pump: Q8.1(G)
Water Valve: Q7.1(G)
NetD8_2: D8.2(A) K1.5 Q5.3(D)
NetD9_2: D9.2(A) K2.5 Q6.3(D)
NetD10_2: D10.2(A) K3.5 Q7.3(D)
NetD11_2: D11.2(A) K4.5 Q8.3(D)
NetD12_2: D12.2(A) K5.5 Q10.3(D)
NetD13_2: D13.2(A) K6.5 Q9.3(D)
NetJ5_2: J5.2 K1.1
NetJ6_2: J6.2 K2.1
NetJ7_2: J7.2 K3.1
NetJ8_2: J8.2 K4.1
NetJ9_2: J9.2 K5.1
NetJ10_2: J10.2 K6.1

Not connected (* = marked no-connect by the designer): K1 4; K2 4; K3 4; K4 4; K5 4; K6 4

### Library data of the parts
D8-D13 = CMP-12791-000025-1: as D14 on sheet HBridge; Forward Current: 300mA; Temperature: -65°C to +150°C; Device Class L3: Rectifier Diodes; Manufacturer Part Number: 1N4148WQ-7-F; Temperature Range Low: -65°C; Device Class L1: Discrete Semiconductors; Reverse Voltage: 100V; Automotive: Yes; Temperature Range High: +150°C; Octopart: https://octopart.com/1n4148wq-7-f-diodes+inc.-34965875; ComponentLink2URL: https://www.diodes.com/assets/Datasheets/ds30086.pdf; Max Repetitive Reverse Voltage: 100V; Mouser Description: Diode Switching 100V 0.15A Automotive 2-Pin SOD-123 T/R; Ipc Land Pattern Name: SOD365155X123-2; RoHS: TRUE; Height: 1.45mm; ComponentLink2Description: Datasheet; Category: Diode; Footprint Url: https://www.diodes.com/assets/Package-Files/SOD123.pdf; Package: SOD123; Device Class L2: Diodes; Lead Free: Yes; Capacitance: 2pF; Digikey Description: DIODE GEN PURP 100V 300MA SOD123
J5-J10 = CMP-2000-05299-1: as J2 on sheet HBridge; Colour: Green; Manufacturer part No.: 1725656; Type: MPT0,5/2-2,54; Datasheet URL: http://datasheet.octopart.com/1725656-Phoenix-Contact-datasheet-5302866.pdf; Manufacturer URL: http://www.phoenixcontact.com/; Datasheet Version: Apr-08
K1-K6 = CMP-08822-000008-1: RELAY GEN PURPOSE SPDT 10A 5V; Manufacturer: Omron; Number Of Contacts: 1; Coil Type: Non-Latching; Coil Current: 79.4mA; Coil Power: 400mW; Coil Resistance: 63Ω; Standoff Height: 0.5mm; Throw Configuration: SPDT; Ambient Temperature Range Low: -25°C; Package: 0; Device Class L2: Relays; Temperature Range High: +85°C; ComponentLink2Description: Datasheet; Octopart: https://octopart.com/g5le-14-dc5-omron-28829; Coil Voltage: 5V; Lead Free: Yes; Digikey Description: RELAY GEN PURPOSE SPDT 10A 5V; Device Class L1: Electromechanical; Device Class L3: Power Relays; ComponentLink2URL: https://omronfs.omron.com/en_US/ecb/products/pdf/en-g5le.pdf; Temperature: -25°C to +85°C; Ambient Temperature Range High: +85°C; RoHS: TRUE; Automotive: No; Height: 19mm; Category: Relay; Manufacturer Part Number: G5LE-14-DC5; Mouser Description: General Purpose Relays Power PCB Relay SPDT Sealed 5VDC; Current Rating: 10A; Switching Current: 10A; Temperature Range Low: -25°C
Q5-Q10 = CMP-07173-000101-1: MOSFET N-CH 50V 220MA SOT-23; Turn-Off Delay Time: 20ns; Element Configuration: Single; Rds On Max: 3.5R; Gate to Source Voltage (Vgs): 20V; Threshold Voltage: 1.3V; Number of Elements: 1; Power Dissipation: 360mW; Rise Time: 9ns; Turn-On Delay Time: 2.5ns; Input Capacitance: 27pF; On-State Resistance: 6R; Lead Free: Lead Free; Length: 2.92mm; Width: 1.3mm; Drain to Source Breakdown Voltage: 50V; Min Operating Temperature: -55°C; REACH SVHC: No SVHC; Packaging: Tape and Reel; Radiation Hardening: No; Height: 0.93mm; Drain to Source Voltage (Vdss): 50V; Current Rating: 220mA; Voltage Rating (DC): 50V; Weight: 0.03g; Continuous Drain Current (ID): 220mA; Number of Pins: 3; Nominal Vgs: 1.3V; Max Power Dissipation: 360mW; Fall Time: 9ns; Drain to Source Resistance: 3.5R; Contact Plating: Tin; Case/Package: SOT-23; Package Quantity: 1; Dual Supply Voltage: 50V; Mount: Surface Mount; Termination: SMD/SMT; Max Operating Temperature: 150°C

## Sheet Triac.SchDoc
size A1; SheetNumber: 5; SheetTotal: 5
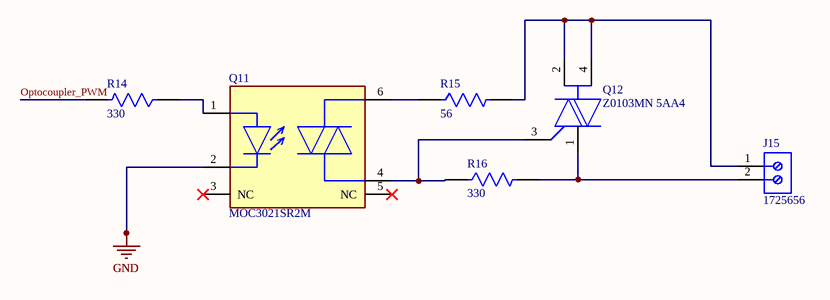
[diagram p4: Triac.SchDoc]

### Parts
J15  1725656  [PHOE-1725656-2]
Q11  MOC3021SR2M  [FP-646BY-MFG]
Q12  Z0103MN 5AA4  [FP-SOT-223-MFG]
R14  Resistance: 330  [FP-MCA1206-IPC_B]  (hidden comment: MCA1206MD1002DP500)
R15  Resistance: 56  [FP-MCA1206-IPC_B]  (hidden comment: MCA1206MD1002DP500)
R16  Resistance: 330  [FP-MCA1206-IPC_B]  (hidden comment: MCA1206MD1002DP500)

### Nets
GND: Q11.2(C)
Optocoupler_PWM: R14.2
NetJ15_1: J15.1 Q12.2(A2) Q12.4(A2) R15.2
NetJ15_2: J15.2 Q12.1(A1) R16.2
NetQ11_1: Q11.1(A) R14.1
NetQ11_4: Q11.4(1_MAIN_TERM.) Q12.3(G) R16.1
NetQ11_6: Q11.6(2_MAIN_TERM.) R15.1

Not connected (* = marked no-connect by the designer): Q11 3(NC)* 5(NC)*

### Library data of the parts
J15 = CMP-2000-05299-1: as J2 on sheet HBridge; Colour: Green; Manufacturer part No.: 1725656; Type: MPT0,5/2-2,54; Datasheet URL: http://datasheet.octopart.com/1725656-Phoenix-Contact-datasheet-5302866.pdf; Manufacturer URL: http://www.phoenixcontact.com/; Datasheet Version: Apr-08
Q11 = CMP-00278-84330365-1: MOC3021SR2M Triac Driver Output Optocoupler, 6-Pin DIP 400V Random Phase; Manufacturer Lifecycle Status: ACTIVE; Number of Channels: 1; Reverse Breakdown Voltage: 3V; Max Input Current: 60mA; Forward Voltage: 1.15V; Max Power Dissipation: 330mW; Max Input Voltage: 1.5V; Approvals: UL; Isolation Voltage: 5.3kV; Hold Current: 100µA; RoHS: Compliant; Case/Package: SMD/SMT; Number of Elements: 1; Input Current: 60mA; Forward Current: 60mA; Output Voltage: 400V; Schedule B: 8541408000, 8541408000; REACH SVHC: No SVHC; Number of Pins: 6; Max Operating Temperature: 85°C; Weight: 810mg; Power Dissipation: 330mW; Mount: Surface Mount; Lead Free: Lead Free; Nominal Input Voltage: 1.15V; Radiation Hardening: No; Lifecycle Status: Production; NexarPartId: 84330365; Number of Circuits: 1; Min Operating Temperature: -40°C
Q12 = CMP-12193-000012-1: TRIAC SENS GATE 600V 1A SOT223; Element Configuration: Single; Hold Current: 7mA; Max Operating Temperature: 125°C; Case/Package: SOT-223; RoHS Compliant: Yes; Weight: 0.006632oz; Radiation Hardening: No; Termination: SMD/SMT; Max Repetitive Reverse Voltage (Vrrm): 600V; REACH SVHC: No SVHC; Number of Pins: 3; Min Operating Temperature: -40°C; Height: 1.8mm; Series: -; RMS Current (Irms): 1A; Packaging: Tape and Reel; Lead Free: Lead Free; Width: 3.7mm; Mount: Surface Mount; Package Quantity: 1000; Voltage Rating (DC): 600V; Current Rating: 1A; Length: 6.7mm
R14-R16 = CMP-02407-011266-1: as R4 on sheet HBridge; Weight: 0.000325oz; Height: 0.55mm; Case Code (Imperial): 1206; Packaging: Tape and Reel; Series: MCA AT - Professional; Width: 1.6mm; Resistor Type: Thin Film; Tolerance: 0.5%; Max Operating Temperature: 175°C; Termination: SMD/SMT; Min Operating Temperature: -55°C; Temperature Coefficient: 25ppm/°C; Number of Terminations: 2; Length: 3.2mm; RoHS Compliant: Yes; Case Code (Metric): 3216; Case/Package: 1206; Features: Automotive AEC-Q200; Power Rating: 400mW

## Nets that join several sheets
+12V: PowerSupply (5 pins), HBridge (6 pins), Microcontroller (D2.1 TP3.1)
GND: PowerSupply (9 pins), HBridge (11 pins), Microcontroller (37 pins), Relay (12 pins), Triac (Q11.2)
VCC: PowerSupply (CC2.1 CE2.2 U5.1), HBridge (7 pins), Microcontroller (TP1.1), Relay (18 pins)
Detergent Pump: Microcontroller (U2.47), Relay (Q9.1)
Detergent Valve: Microcontroller (U2.50), Relay (Q5.1)
Drain Pump: Microcontroller (U2.46), Relay (Q10.1)
Drain Valve: Microcontroller (U2.49), Relay (Q6.1)
HBridgeH: HBridge (U3.1 U4.2), Microcontroller (U2.15)
HBridgeL: HBridge (U3.2 U4.1), Microcontroller (U2.16)
Optocoupler_PWM: Microcontroller (U2.14), Triac (R14.2)
Water Pump: Microcontroller (U2.48), Relay (Q8.1)
Water Valve: Microcontroller (U2.51), Relay (Q7.1)